# Altium project S6_Fuel_counter_h.PrjPcb
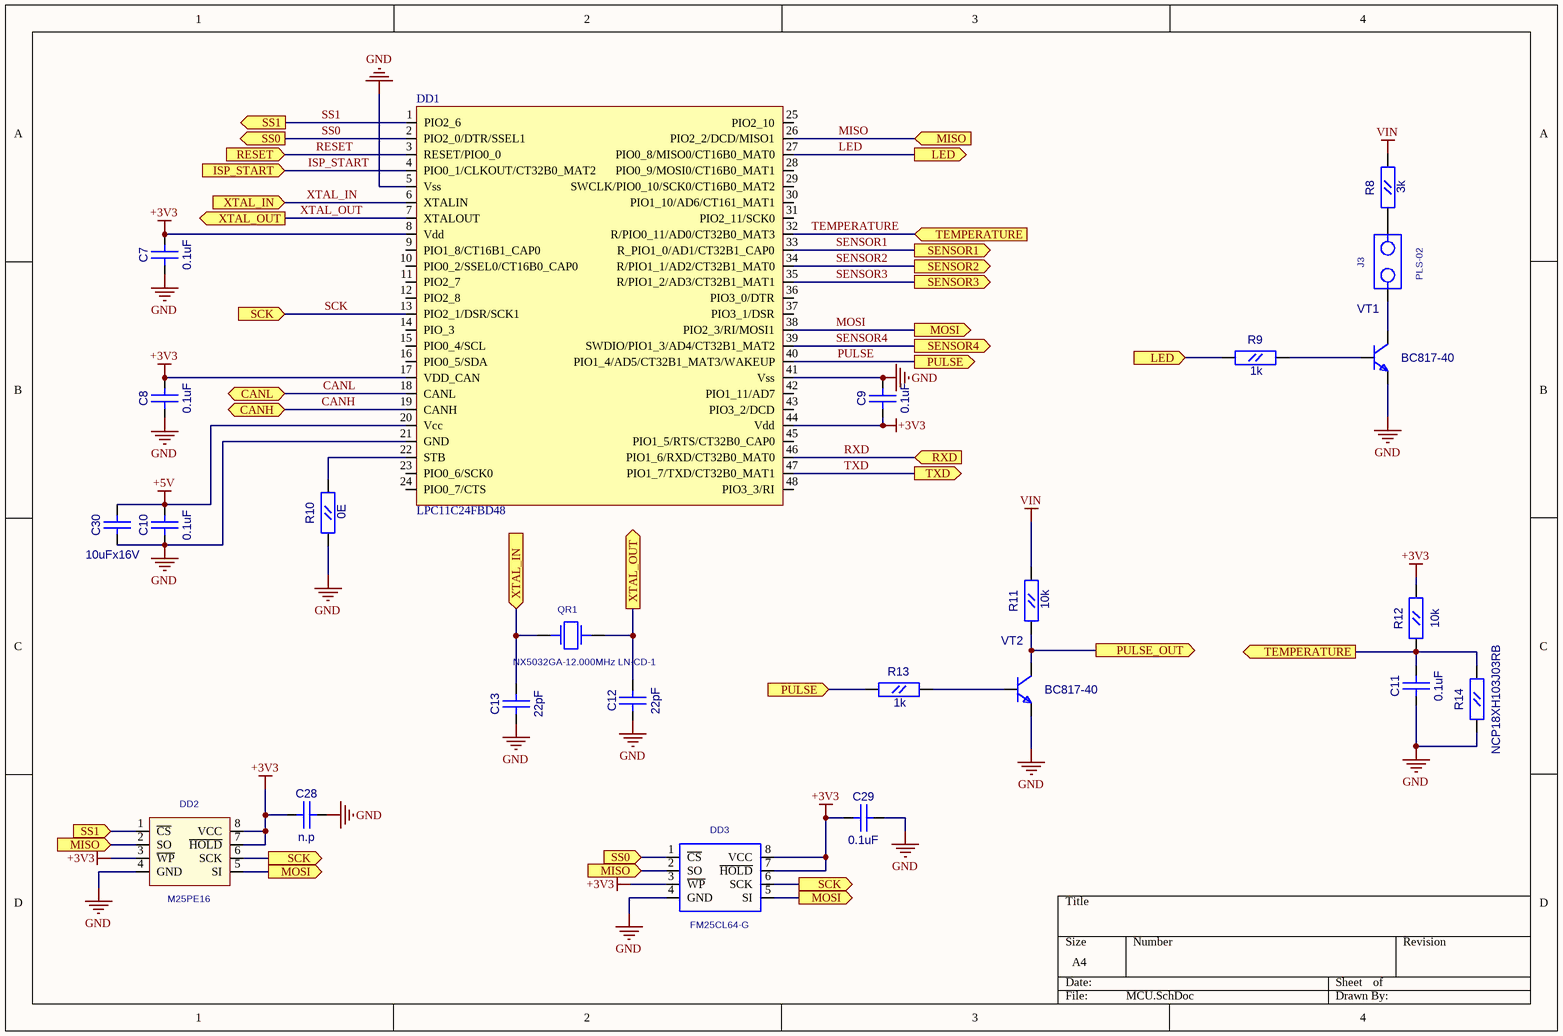
[diagram p0: MCU.SchDoc]
4 sheets, 82 parts. Net scope: flat (ports and power ports of the same name join across sheets).
Board file: S6_Fuel_counter_h.PcbDoc
Sheets:
  MCU.SchDoc
  Hall_sensor.SchDoc
  Connections.SchDoc
  Power.SchDoc

## Sheet MCU.SchDoc
size A4

### Parts
C7  0.1uF  [CC0603]
C8  0.1uF  [CC0603]
C9  0.1uF  [CC0603]
C10  0.1uF  [CC0603]
C11  0.1uF  [CC0603]
C12  22pF  [CC0603]
C13  22pF  [CC0603]
C28  n.p  [CC0603]
C29  0.1uF  [CC0603]
C30  10uFx16V  [CC0805]
DD1  LPC11C24FBD48  [LQFP-48]
DD2  M25PE16  [EIAJ_SO8]
DD3  FM25CL64-G  [SO-8]
J3  PLS-02  [PLS-02]
QR1  NX5032GA-12.000MHz LN-CD-1  [AC5032_2]
R8  3k  [RC0603]
R9  1k  [RC0603]
R10  0E  [RC0603]
R11  10k  [RC0603]
R12  10k  [RC0603]
R13  1k  [RC0603]
R14  NCP18XH103J03RB  [RC0603]
VT1  BC817-40  [SOT-23(123)]
VT2  BC817-40  [SOT-23(123)]

### Ports
CANH (bidir), CANL (bidir), ISP_START (in), LED (in), LED (out), MISO (in), MOSI (out), PULSE (in), PULSE (out), PULSE_OUT (out), RESET (in), RXD (in), SCK (in), SCK (out), SENSOR1 (out), SENSOR2 (out), SENSOR3 (out), SENSOR4 (out), SS0 (in), SS0 (out), SS1 (in), SS1 (out), TEMPERATURE (in), TEMPERATURE (out), TXD (out), XTAL_IN (in), XTAL_OUT (out)

### Nets
+3V3: C7.2(B) C8.2(B) C9.1(A) C28.1(A) C29.1(A) DD1.8(Vdd) DD1.17(VDD_CAN) DD1.44(Vdd) DD2.3(~{WP}) DD2.7(~{HOLD}) DD2.8(VCC) DD3.3(~{WP}) DD3.7(~{HOLD}) DD3.8(VCC) R12.2(B)
+5V: C10.2(B) C30.2(B) DD1.20(Vcc)
GND: C7.1(A) C8.1(A) C9.2(B) C10.1(A) C11.1(A) C12.1(A) C13.1(A) C28.2(B) C29.2(B) C30.1(A) DD1.5(Vss) DD1.21(GND) DD1.41(Vss) DD2.4(GND) DD3.4(GND) R10.1(A) R14.1(A) VT1.2(E) VT2.2(E)
VIN: R8.2(B) R11.2(B)
CANH: DD1.19(CANH) ; port CANH
CANL: DD1.18(CANL) ; port CANL
ISP_START: DD1.4(PIO0_1/CLKOUT/CT32B0_MAT2) ; port ISP_START
LED: DD1.27(PIO0_8/MISO0/CT16B0_MAT0) R9.1(A) ; port LED
MISO: DD1.26(PIO2_2/DCD/MISO1) DD2.2(SO) DD3.2(SO) ; port MISO
MOSI: DD1.38(PIO2_3/RI/MOSI1) DD2.5(SI) DD3.5(SI) ; port MOSI
PULSE: DD1.40(PIO1_4/AD5/CT32B1_MAT3/WAKEUP) R13.1(A) ; port PULSE
RESET: DD1.3(RESET/PIO0_0) ; port RESET
RXD: DD1.46(PIO1_6/RXD/CT32B0_MAT0) ; port RXD
SCK: DD1.13(PIO2_1/DSR/SCK1) DD2.6(SCK) DD3.6(SCK) ; port SCK
SENSOR1: DD1.33(R_PIO1_0/AD1/CT32B1_CAP0) ; port SENSOR1
SENSOR2: DD1.34(R/PIO1_1/AD2/CT32B1_MAT0) ; port SENSOR2
SENSOR3: DD1.35(R/PIO1_2/AD3/CT32B1_MAT1) ; port SENSOR3
SENSOR4: DD1.39(SWDIO/PIO1_3/AD4/CT32B1_MAT2) ; port SENSOR4
SS0: DD1.2(PIO2_0/DTR/SSEL1) DD3.1(~{CS}) ; port SS0
SS1: DD1.1(PIO2_6) DD2.1(~{CS}) ; port SS1
TEMPERATURE: C11.2(B) DD1.32(R/PIO0_11/AD0/CT32B0_MAT3) R12.1(A) R14.2(B) ; port TEMPERATURE
TXD: DD1.47(PIO1_7/TXD/CT32B0_MAT1) ; port TXD
XTAL_IN: C13.2(B) DD1.6(XTALIN) QR1.1 ; port XTAL_IN
XTAL_OUT: C12.2(B) DD1.7(XTALOUT) QR1.2 ; port XTAL_OUT
NetDD1_22: DD1.22(STB) R10.2(B)
NetJ3_1: J3.1 VT1.3(C)
NetJ3_2: J3.2 R8.1(A)
NetR9_2: R9.2(B) VT1.1(B)
NetR11_1: R11.1(A) VT2.3(C) ; port PULSE_OUT
NetR13_2: R13.2(B) VT2.1(B)

Not connected (* = marked no-connect by the designer): DD1 9(PIO1_8/CT16B1_CAP0) 10(PIO0_2/SSEL0/CT16B0_CAP0) 11(PIO2_7) 12(PIO2_8) 14(PIO_3) 15(PIO0_4/SCL) 16(PIO0_5/SDA) 23(PIO0_6/SCK0) 24(PIO0_7/CTS) 25(PIO2_10) 28(PIO0_9/MOSI0/CT16B0_MAT1) 29(SWCLK/PIO0_10/SCK0/CT16B0_MAT2) 30(PIO1_10/AD6/CT161_MAT1) 31(PIO2_11/SCK0) 36(PIO3_0/DTR) 37(PIO3_1/DSR) 42(PIO1_11/AD7) 43(PIO3_2/DCD) 45(PIO1_5/RTS/CT32B0_CAP0) 48(PIO3_3/RI)

### Library data of the parts
C7-C13 C28 C29 = CC0603
  C7-C11 C29: Value: 0.1uF
  C12 C13: Value: 22pF
  C28: Value: n.p
C30 = CC0805: Value: 10uFx16V
DD2 = S25FL016A0LMFI01: Value: M25PE16
QR1 = AC5032_2: AC5032/2; Value: NX5032GA-12.000MHz LN-CD-1
R8-R14 = RC0603
  R8: Value: 3k
  R9 R13: Value: 1k
  R10: Value: 0E
  R11 R12: Value: 10k
  R14: Value: NCP18XH103J03RB
VT1 VT2 = BC846BLT1: NPN 500ma transistor; ComponentField7: Published 29-Sep-2000; OriginalName: BC846BLT1; Value: BC817-40
DD1 = LPC11C24FBD48: Value: LPC11C24FBD48
DD3 = FM25CL64-G: Value: *
J3 = PLS-02: Value: *

## Sheet Hall_sensor.SchDoc
size A4
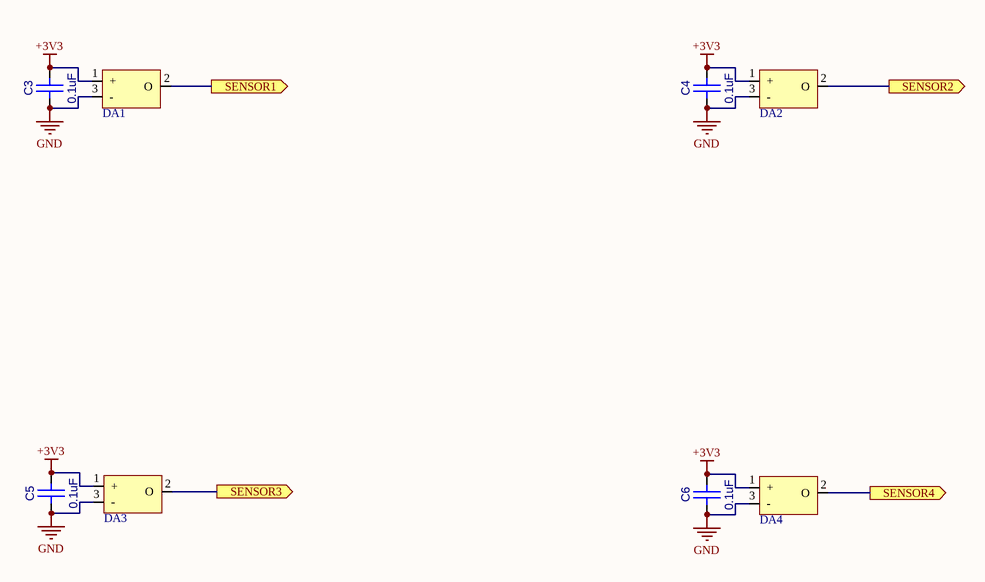
[diagram p1: Hall_sensor.SchDoc]

### Parts
C3  0.1uF  [CC0603]
C4  0.1uF  [CC0603]
C5  0.1uF  [CC0603]
C6  0.1uF  [CC0603]
DA1  DRV5033AJQDBZR  [SOT-23(123)]  (value not drawn)
DA2  DRV5033AJQDBZR  [SOT-23(123)]  (value not drawn)
DA3  DRV5033AJQDBZR  [SOT-23(123)]  (value not drawn)
DA4  DRV5033AJQDBZR  [SOT-23(123)]  (value not drawn)

### Ports
SENSOR1 (out), SENSOR2 (out), SENSOR3 (out), SENSOR4 (out)

### Nets
+3V3: C3.2(B) C4.2(B) C5.2(B) C6.2(B) DA1.1(+) DA2.1(+) DA3.1(+) DA4.1(+)
GND: C3.1(A) C4.1(A) C5.1(A) C6.1(A) DA1.3(-) DA2.3(-) DA3.3(-) DA4.3(-)
SENSOR1: DA1.2(O) ; port SENSOR1
SENSOR2: DA2.2(O) ; port SENSOR2
SENSOR3: DA3.2(O) ; port SENSOR3
SENSOR4: DA4.2(O) ; port SENSOR4

### Library data of the parts
C3-C6 = CC0603: Value: 0.1uF
DA1-DA4 = DRV5033: Hall sensor; Value: DRV5033AJQDBZR

## Sheet Connections.SchDoc
size A4
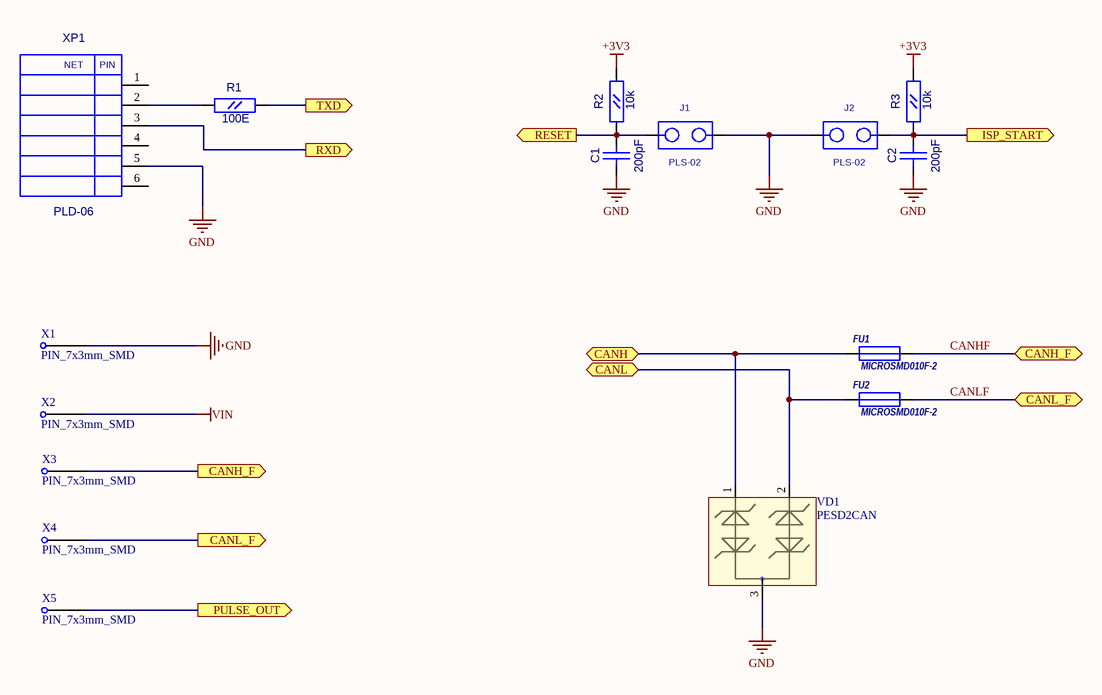
[diagram p2: Connections.SchDoc]

### Parts
C1  200pF  [CC0603]
C2  200pF  [CC0603]
FU1  MICROSMD010F-2  [RC1210]
FU2  MICROSMD010F-2  [RC1210]
J1  PLS-02  [PLS-02]
J2  PLS-02  [PLS-02]
R1  100E  [RC0603]
R2  10k  [RC0603]
R3  10k  [RC0603]
VD1  PESD2CAN  [SOT-23(123)]
X1  PIN_7x3mm_SMD  [PIN_7x3mm_SMD]
X2  PIN_7x3mm_SMD  [PIN_7x3mm_SMD]
X3  PIN_7x3mm_SMD  [PIN_7x3mm_SMD]
X4  PIN_7x3mm_SMD  [PIN_7x3mm_SMD]
X5  PIN_7x3mm_SMD  [PIN_7x3mm_SMD]
XP1  PLD-06  [PIN6]

### Ports
CANH, CANH_F, CANH_F (out), CANL, CANL_F, CANL_F (out), ISP_START (out), PULSE_OUT (out), RESET (out), RXD (out), TXD (out)

### Nets
+3V3: R2.2(B) R3.2(B)
GND: C1.1(A) C2.1(A) J1.2 J2.1 VD1.3 X1.1 XP1.5
VIN: X2.1
CANH: FU1.1 VD1.1 ; port CANH
CANHF: FU1.2 X3.1 ; port CANH_F
CANL: FU2.1 VD1.2 ; port CANL
CANLF: FU2.2 X4.1 ; port CANL_F
ISP_START: C2.2(B) J2.2 R3.1(A) ; port ISP_START
RESET: C1.2(B) J1.1 R2.1(A) ; port RESET
RXD: XP1.3 ; port RXD
TXD: R1.2(B) ; port TXD
NetR1_1: R1.1(A) XP1.2
NetR11_1: X5.1 ; port PULSE_OUT

Not connected (* = marked no-connect by the designer): XP1 1 4 6

### Library data of the parts
C1 C2 = CC0603: Value: 200pF
FU1 FU2 = MICROSMD: Value: MICROSMD010F-2
R1-R3 = RC0603
  R1: Value: 100E
  R2 R3: Value: 10k
VD1 = PESD2CAN: TVS for CAN
XP1 = PLD-06: PLD06; Value: *
J1 J2 = PLS-02: Value: *

## Sheet Power.SchDoc
size A4
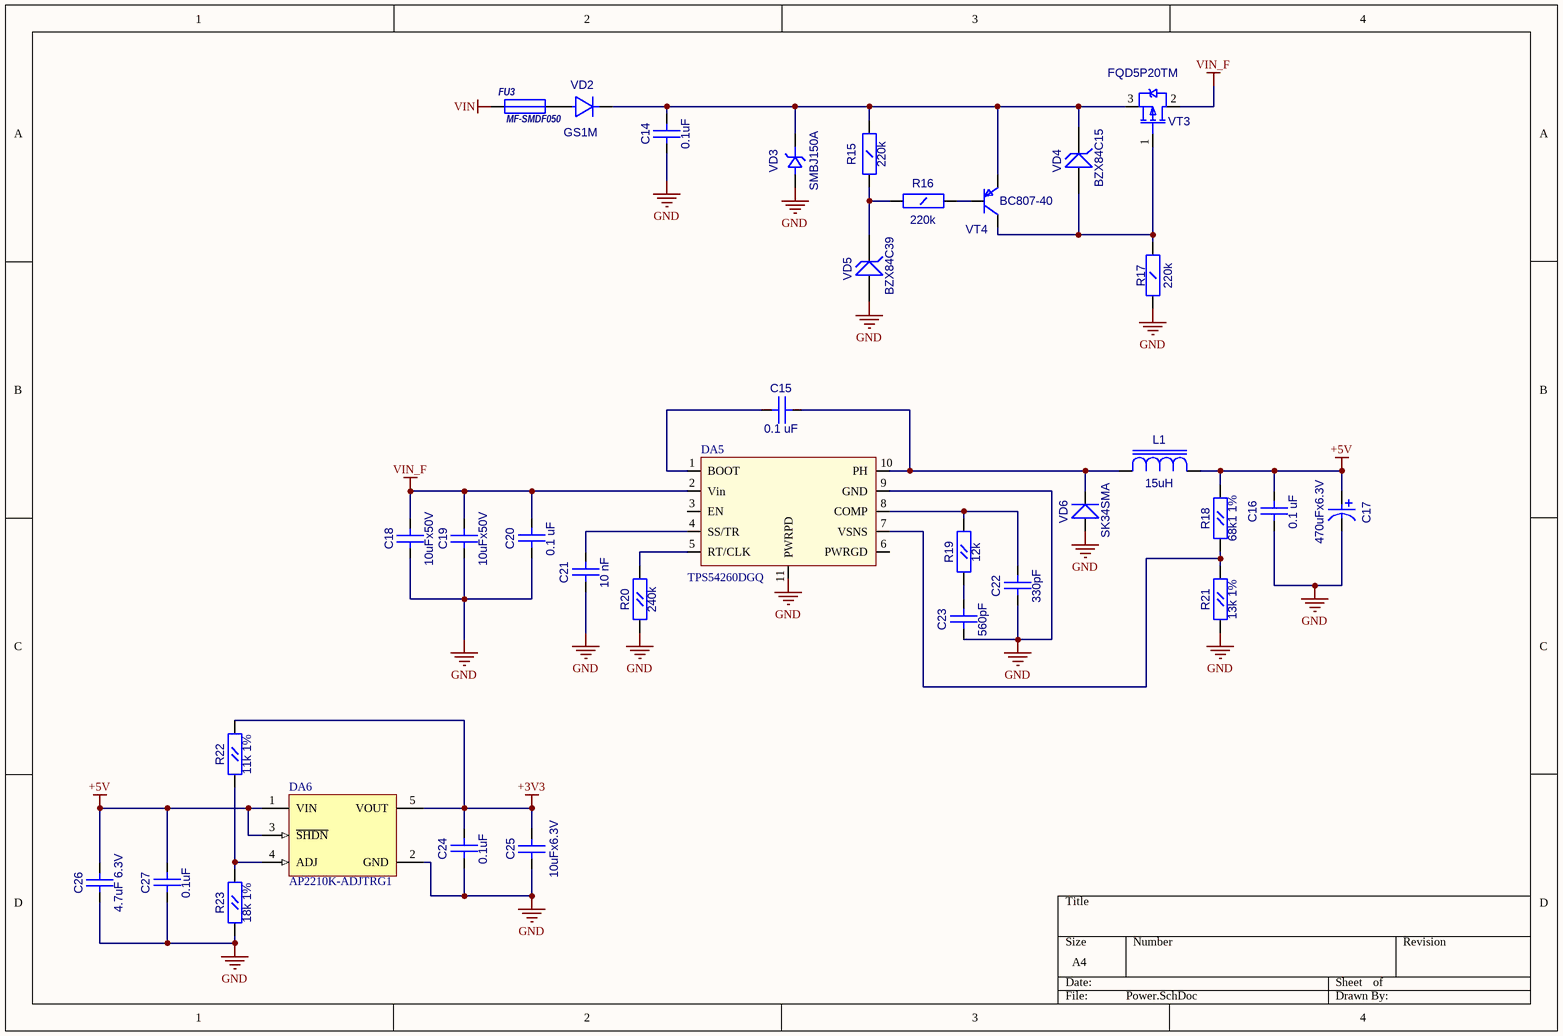
[diagram p3: Power.SchDoc]

### Parts
C14  0.1uF  [CC1206]
C15  0.1 uF  [CC0603]
C16  0.1 uF  [CC0603]
C17  470uFx6.3V  [TAJ-D-1M]
C18  10uFx50V  [CC1210]
C19  10uFx50V  [CC1210]
C20  0.1 uF  [CC0603]
C21  10 nF  [CC0603]
C22  330pF  [CC0603]
C23  560pF  [CC0603]
C24  0.1uF  [CC0603]
C25  10uFx6.3V  [CC0805]
C26  4.7uF 6.3V  [CC0805]
C27  0.1uF  [CC0603]
DA5  TPS54260DGQ  [S-PDSO-G10]
DA6  AP2210K-ADJTRG1  [SOT23-5]
FU3  MF-SMDF050  [MF-SMDF]
L1  15uH  [SDR0603]
R15  220k  [RC1206]
R16  220k  [RC1206]
R17  220k  [RC1206]
R18  68k1 1%  [RC0603]
R19  12k  [RC0603]
R20  240k  [RC0603]
R21  13k 1%  [RC0603]
R22  11k 1%  [RC0603]
R23  18k 1%  [RC0603]
VD2  GS1M  [SMA]
VD3  SMBJ150A  [SMB]
VD4  BZX84C15  [SOT-23(123)]
VD5  BZX84C39  [SOT-23(123)]
VD6  SK34SMA  [SMA]
VT3  FQD5P20TM  [D-PAK(TO-252AA)]
VT4  BC807-40  [SOT-23(123)]

### Nets
+3V3: C24.1(A) C25.2(B) DA6.5(VOUT) R22.2(B)
+5V: C16.1(A) C17.1(A) C26.2(B) C27.1(A) DA6.1(VIN) DA6.3(~{SHDN}) L1.2 R18.2(B)
GND: C14.1(A) C16.2(B) C17.2(B) C18.1(A) C19.1(A) C20.2(B) C21.2(B) C22.2(B) C23.2(B) C24.2(B) C25.1(A) C26.1(A) C27.2(B) DA5.9(GND) DA5.11(PWRPD) DA6.2(GND) R17.2(B) R20.1(A) R21.1(A) R23.1(A) VD3.1(A) VD5.1(A) VD6.1(A)
VIN: FU3.1
VIN_F: C18.2(B) C19.2(B) C20.1(A) DA5.2(Vin) VT3.2(D)
NetC14_2: C14.2(B) R15.2(B) VD2.2(K) VD3.2(K) VD4.3(K) VT3.3(S) VT4.2(E)
NetC15_1: C15.1(A) DA5.10(PH) L1.1 VD6.2(K)
NetC15_2: C15.2(B) DA5.1(BOOT)
NetC21_1: C21.1(A) DA5.4(SS/TR)
NetC22_1: C22.1(A) DA5.8(COMP) R19.2(B)
NetC23_1: C23.1(A) R19.1(A)
NetDA5_5: DA5.5(RT/CLK) R20.2(B)
NetDA5_7: DA5.7(VSNS) R18.1(A) R21.2(B)
NetDA6_4: DA6.4(ADJ) R22.1(A) R23.2(B)
NetFU3_2: FU3.2 VD2.1(A)
NetR15_1: R15.1(A) R16.1(A) VD5.3(K)
NetR16_2: R16.2(B) VT4.1(B)
NetR17_1: R17.1(A) VD4.1(A) VT3.1(G) VT4.3(C)

Not connected (* = marked no-connect by the designer): DA5 3(EN) 6(PWRGD)

### Library data of the parts
C14 = CC1206: Value: 0.1uF
C15 C16 C20-C24 C27 = CC0603
  C15 C16 C20: Value: 0.1 uF
  C21: Value: 10 nF
  C22: Value: 330pF
  C23: Value: 560pF
  C24 C27: Value: 0.1uF
C17 = TAJ-D: Value: 470uFx6.3V
C18 C19 = CC1210: Value: 10uFx50V
C25 C26 = CC0805
  C25: Value: 10uFx6.3V
  C26: Value: 4.7uF 6.3V
DA6 = MCP1824T-ADJE/OT: 300 mA, Low Voltage, Low Quiescent Current LDO Regulator, 5-Pin SOT-223, Extended Temperature, Tape and Reel; Published: 29-Jan-2009; DatasheetVersion: revA, Aug-2007; PackageVersion: revAW, Oct-2008; PackageReference: SOT-223-DC5; Publisher: Altium Limited; PackageDescription: 5-Lead Plastic Small Outline Transistor (DC) [SOT-223]; ComponentLink1Description: Manufacturer Link; ComponentLink1URL: http://www.microchip.com; ComponentLink2Description: Datasheet; ComponentLink2URL: http://ww1.microchip.com/downloads/en/DeviceDoc/22070a.pdf; ComponentLink3Description: Packaging Specification; ComponentLink3URL: http://ww1.microchip.com/downloads/en/PackagingSpec/00049AW.pdf
FU3 = MF-SMDF: Value: MF-SMDF050
L1 = SDR0603: Value: 15uH
R15-R17 = RC1206: Value: 220k
R18-R23 = RC0603
  R18: Value: 68k1 1%
  R19: Value: 12k
  R20: Value: 240k
  R21: Value: 13k 1%
  R22: Value: 11k 1%
  R23: Value: 18k 1%
VD2 = GS1M: Value: {Value}
VD3 = SMBJ: Value: SMBJ150A
VD4 VD5 = BZX84: Zener Voltage Regulator Diode; Value: {Value}
VD6 = SK34SMA: Schottky Rectifier; Value: {Value}
VT3 = IRFR9220: HEXFET Power MOSFET; OriginalName: IRLML5103; ComponentField7: Published 8-Jun-2000; Value: FQD5P20TM
VT4 = BC857B: OriginalName: BC846BLT1; ComponentField7: Published 29-Sep-2000; Value: BC807-40

## Nets that join several sheets
+3V3: MCU (15 pins), Hall_sensor (8 pins), Connections (R2.2 R3.2), Power (C24.1 C25.2 DA6.5 R22.2)
+5V: MCU (C10.2 C30.2 DD1.20), Power (8 pins)
GND: MCU (19 pins), Hall_sensor (8 pins), Connections (7 pins), Power (23 pins)
VIN: MCU (R8.2 R11.2), Connections (X2.1), Power (FU3.1)
CANH: MCU (DD1.19), Connections (FU1.1 VD1.1)
CANL: MCU (DD1.18), Connections (FU2.1 VD1.2)
ISP_START: MCU (DD1.4), Connections (C2.2 J2.2 R3.1)
NetR11_1: MCU (R11.1 VT2.3), Connections (X5.1)
RESET: MCU (DD1.3), Connections (C1.2 J1.1 R2.1)
RXD: MCU (DD1.46), Connections (XP1.3)
SENSOR1: MCU (DD1.33), Hall_sensor (DA1.2)
SENSOR2: MCU (DD1.34), Hall_sensor (DA2.2)
SENSOR3: MCU (DD1.35), Hall_sensor (DA3.2)
SENSOR4: MCU (DD1.39), Hall_sensor (DA4.2)
TXD: MCU (DD1.47), Connections (R1.2)